# Altium schematic sheet ZynqCoreBoard2.SchDoc
size A3
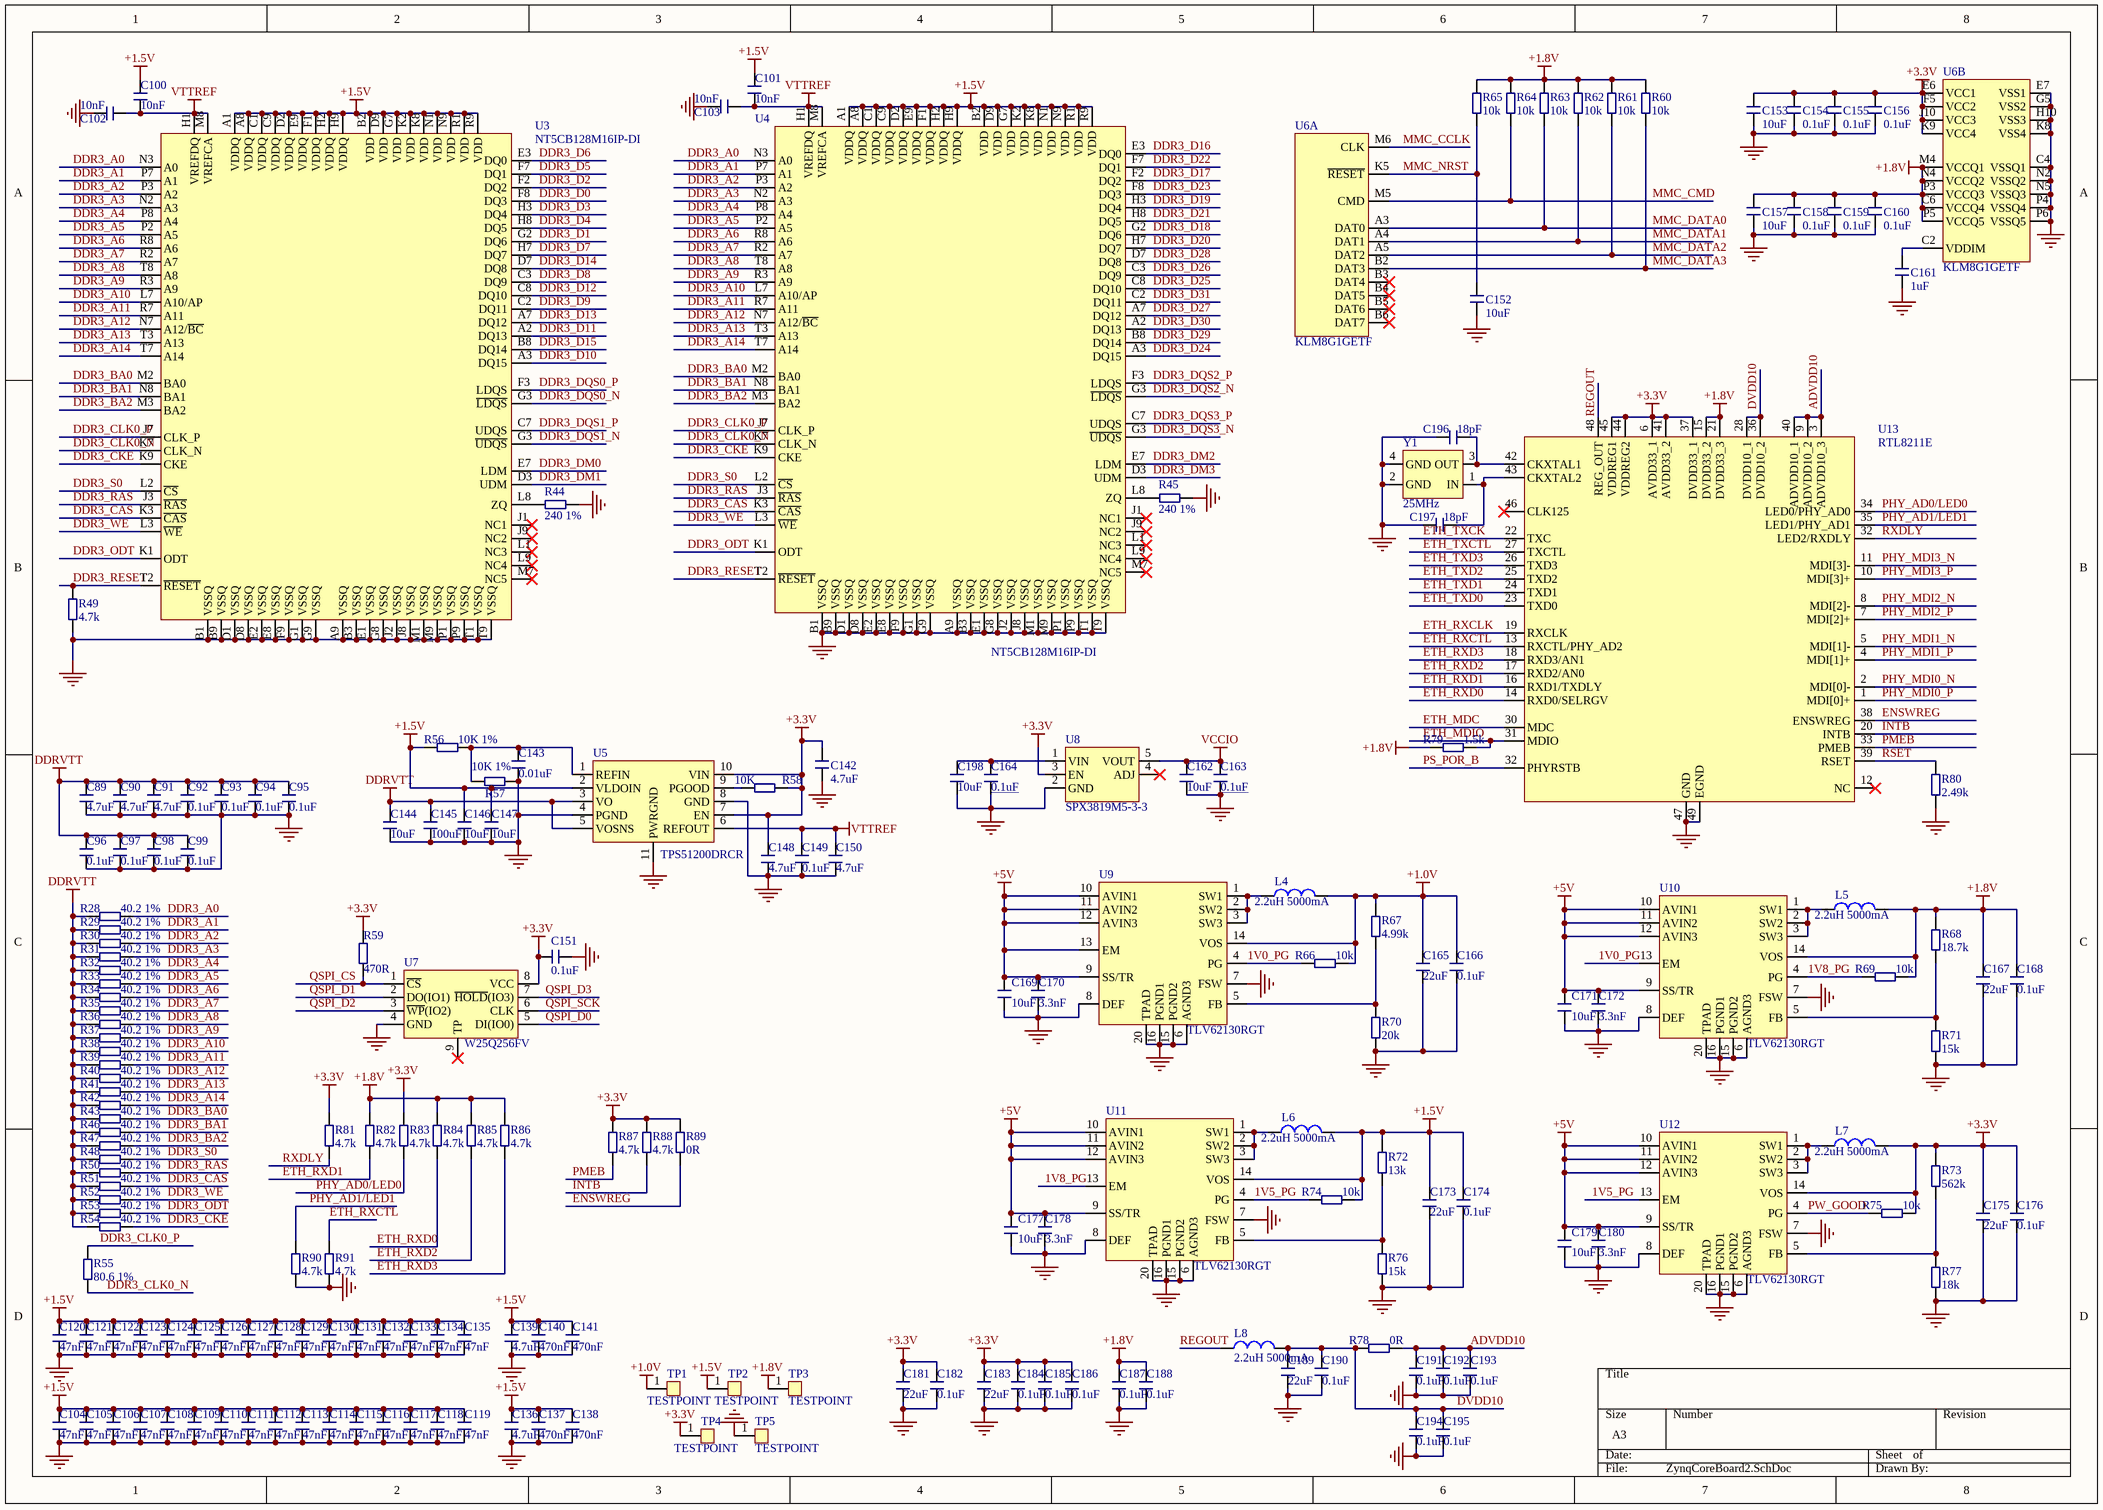
[diagram p0: ZynqCoreBoard2.SchDoc]

## Parts
C89  4.7uF  [C0402]
C90  4.7uF  [C0402]
C91  4.7uF  [C0402]
C92  0.1uF  [C0402]
C93  0.1uF  [C0402]
C94  0.1uF  [C0402]
C95  0.1uF  [C0402]
C96  0.1uF  [C0402]
C97  0.1uF  [C0402]
C98  0.1uF  [C0402]
C99  0.1uF  [C0402]
C100  10nF  [C0402]
C101  10nF  [C0402]
C102  10nF  [C0402]
C103  10nF  [C0402]
C104  47nF  [C0402]
C105  47nF  [C0402]
C106  47nF  [C0402]
C107  47nF  [C0402]
C108  47nF  [C0402]
C109  47nF  [C0402]
C110  47nF  [C0402]
C111  47nF  [C0402]
C112  47nF  [C0402]
C113  47nF  [C0402]
C114  47nF  [C0402]
C115  47nF  [C0402]
C116  47nF  [C0402]
C117  47nF  [C0402]
C118  47nF  [C0402]
C119  47nF  [C0402]
C120  47nF  [C0402]
C121  47nF  [C0402]
C122  47nF  [C0402]
C123  47nF  [C0402]
C124  47nF  [C0402]
C125  47nF  [C0402]
C126  47nF  [C0402]
C127  47nF  [C0402]
C128  47nF  [C0402]
C129  47nF  [C0402]
C130  47nF  [C0402]
C131  47nF  [C0402]
C132  47nF  [C0402]
C133  47nF  [C0402]
C134  47nF  [C0402]
C135  47nF  [C0402]
C136  4.7uF  [C0402]
C137  470nF  [C0402]
C138  470nF  [C0402]
C139  4.7uF  [C0402]
C140  470nF  [C0402]
C141  470nF  [C0402]
C142  4.7uF  [C0402]
C143  0.01uF  [C0402]
C144  10uF  [C0603]
C145  100uF  [C1206]
C146  10uF  [C0603]
C147  10uF  [C0603]
C148  4.7uF  [C0402]
C149  0.1uF  [C0402]
C150  4.7uF  [C0402]
C151  0.1uF  [C0402]
C152  10uF  [C0603]
C153  10uF  [C0603]
C154  0.1uF  [C0402]
C155  0.1uF  [C0402]
C156  0.1uF  [C0402]
C157  10uF  [C0603]
C158  0.1uF  [C0402]
C159  0.1uF  [C0402]
C160  0.1uF  [C0402]
C161  1uF  [C0402]
C162  10uF  [C0805]
C163  0.1uF  [C0402]
C164  0.1uF  [C0402]
C165  22uF  [C0805]
C166  0.1uF  [C0402]
C167  22uF  [C0805]
C168  0.1uF  [C0402]
C169  10uF  [C0603]
C170  3.3nF  [C0402]
C171  10uF  [C0603]
C172  3.3nF  [C0402]
C173  22uF  [C0805]
C174  0.1uF  [C0402]
C175  22uF  [C0805]
C176  0.1uF  [C0402]
C177  10uF  [C0603]
C178  3.3nF  [C0402]
C179  10uF  [C0603]
C180  3.3nF  [C0402]
C181  22uF  [C0805]
C182  0.1uF  [C0402]
C183  22uF  [C0805]
C184  0.1uF  [C0402]
C185  0.1uF  [C0402]
C186  0.1uF  [C0402]
C187  0.1uF  [C0402]
C188  0.1uF  [C0402]
C189  22uF  [C0603]
C190  0.1uF  [C0402]
C191  0.1uF  [C0402]
C192  0.1uF  [C0402]
C193  0.1uF  [C0402]
C194  0.1uF  [C0402]
C195  0.1uF  [C0402]
C196  18pF  [C0402]
C197  18pF  [C0402]
C198  10uF  [C0805]
L4  2.2uH 5000mA  [L-SMD-0630]
L5  2.2uH 5000mA  [L-SMD-0630]
L6  2.2uH 5000mA  [L-SMD-0630]
L7  2.2uH 5000mA  [L-SMD-0630]
L8  2.2uH 5000mA  [L0603]
R28  40.2 1%  [R0402]
R29  40.2 1%  [R0402]
R30  40.2 1%  [R0402]
R31  40.2 1%  [R0402]
R32  40.2 1%  [R0402]
R33  40.2 1%  [R0402]
R34  40.2 1%  [R0402]
R35  40.2 1%  [R0402]
R36  40.2 1%  [R0402]
R37  40.2 1%  [R0402]
R38  40.2 1%  [R0402]
R39  40.2 1%  [R0402]
R40  40.2 1%  [R0402]
R41  40.2 1%  [R0402]
R42  40.2 1%  [R0402]
R43  40.2 1%  [R0402]
R44  240 1%  [R0402]
R45  240 1%  [R0402]
R46  40.2 1%  [R0402]
R47  40.2 1%  [R0402]
R48  40.2 1%  [R0402]
R49  4.7k  [R0402]
R50  40.2 1%  [R0402]
R51  40.2 1%  [R0402]
R52  40.2 1%  [R0402]
R53  40.2 1%  [R0402]
R54  40.2 1%  [R0402]
R55  80.6 1%  [R0402]
R56  10K 1%  [R0402]
R57  10K 1%  [R0402]
R58  10K  [R0402]
R59  470R  [R0402]
R60  10k  [R0402]
R61  10k  [R0402]
R62  10k  [R0402]
R63  10k  [R0402]
R64  10k  [R0402]
R65  10k  [R0402]
R66  10k  [R0402]
R67  4.99k  [R0402]
R68  18.7k  [R0402]
R69  10k  [R0402]
R70  20k  [R0402]
R71  15k  [R0402]
R72  13k  [R0402]
R73  562k  [R0402]
R74  10k  [R0402]
R75  10k  [R0402]
R76  15k  [R0402]
R77  18k  [R0402]
R78  0R  [R0402]
R79  1.5k  [R0402]
R80  2.49k  [R0402]
R81  4.7k  [R0402]
R82  4.7k  [R0402]
R83  4.7k  [R0402]
R84  4.7k  [R0402]
R85  4.7k  [R0402]
R86  4.7k  [R0402]
R87  4.7k  [R0402]
R88  4.7k  [R0402]
R89  0R  [R0402]
R90  4.7k  [R0402]
R91  4.7k  [R0402]
TP1  TESTPOINT  [FPAD_1]
TP2  TESTPOINT  [FPAD_1]
TP3  TESTPOINT  [FPAD_1]
TP4  TESTPOINT  [FPAD_1]
TP5  TESTPOINT  [FPAD_1]
U3  NT5CB128M16IP-DI  [FBGA_96]
U4  NT5CB128M16IP-DI  [FBGA_96]
U5  TPS51200DRCR  [TPS_QFN10]
U6  KLM8G1GETF  [VFBGA]  (parts A,B of 4)
U7  W25Q256FV  [W25Q256FV]
U8  SPX3819M5-3-3  [SOT23-5]
U9  TLV62130RGT  [QFN16_3x3]
U10  TLV62130RGT  [QFN16_3x3]
U11  TLV62130RGT  [QFN16_3x3]
U12  TLV62130RGT  [QFN16_3x3]
U13  RTL8211E  [QFN48]
Y1  25MHz  [OSC 3225-4P]

## Nets
+1.0V: C165.2 C166.2 L4.2 R66.2 R67.2 TP1.1 U9.14(VOS)
+1.5V: C100.2 C101.2 C104.2 C105.2 C106.2 C107.2 C108.2 C109.2 C110.2 C111.2 C112.2 C113.2 C114.2 C115.2 C116.2 C117.2 C118.2 C119.2 C120.2 C121.2 C122.2 C123.2 C124.2 C125.2 C126.2 C127.2 C128.2 C129.2 C130.2 C131.2 C132.2 C133.2 C134.2 C135.2 C136.2 C137.2 C138.2 C139.2 C140.2 C141.2 C146.2 C147.2 C173.2 C174.2 L6.2 R56.1 R72.2 R74.2 TP2.1 U3.A1(VDDQ) U3.A8(VDDQ) U3.B2(VDD) U3.C1(VDDQ) U3.C9(VDDQ) U3.D2(VDDQ) U3.D9(VDD) U3.E9(VDDQ) U3.F1(VDDQ) U3.G7(VDD) U3.H2(VDDQ) U3.H9(VDDQ) U3.K2(VDD) U3.K8(VDD) U3.N1(VDD) U3.N9(VDD) U3.R1(VDD) U3.R9(VDD) U4.A1(VDDQ) U4.A8(VDDQ) U4.B2(VDD) U4.C1(VDDQ) U4.C9(VDDQ) U4.D2(VDDQ) U4.D9(VDD) U4.E9(VDDQ) U4.F1(VDDQ) U4.G7(VDD) U4.H2(VDDQ) U4.H9(VDDQ) U4.K2(VDD) U4.K8(VDD) U4.N1(VDD) U4.N9(VDD) U4.R1(VDD) U4.R9(VDD) U5.2(VLDOIN) U11.14(VOS)
+1.8V: C157.2 C158.2 C159.2 C160.2 C167.2 C168.2 C187.2 C188.2 L5.2 R60.2 R61.2 R62.2 R63.2 R64.2 R65.2 R68.2 R69.2 R79.1 R82.2 R84.2 R85.2 R86.2 TP3.1 U6.C6(VCCQ4) U6.M4(VCCQ1) U6.N4(VCCQ2) U6.P3(VCCQ3) U6.P5(VCCQ5) U10.14(VOS) U13.15(DVDD33_2) U13.21(DVDD33_3)
+3.3V: C142.2 C148.2 C151.2 C153.2 C154.2 C155.2 C156.2 C175.2 C176.2 C181.2 C182.2 C183.2 C184.2 C185.2 C186.2 L7.2 R58.2 R59.2 R73.2 R75.2 R81.2 R83.2 R87.2 R88.2 R89.2 TP4.1 U5.7(EN) U5.10(VIN) U6.E6(VCC1) U6.F5(VCC2) U6.J10(VCC3) U6.K9(VCC4) U7.8(VCC) U8.3(EN) U12.14(VOS) U13.6(AVDD33_1) U13.37(DVDD33_1) U13.41(AVDD33_2) U13.44(VDDREG2) U13.45(VDDREG1)
+5V: C169.2 C170.2 C171.2 C172.2 C177.2 C178.2 C179.2 C180.2 U9.9(SS/TR) U9.10(AVIN1) U9.11(AVIN2) U9.12(AVIN3) U9.13(EM) U10.9(SS/TR) U10.10(AVIN1) U10.11(AVIN2) U10.12(AVIN3) U11.9(SS/TR) U11.10(AVIN1) U11.11(AVIN2) U11.12(AVIN3) U12.9(SS/TR) U12.10(AVIN1) U12.11(AVIN2) U12.12(AVIN3)
DDRVTT: C89.2 C90.2 C91.2 C92.2 C93.2 C94.2 C95.2 C96.2 C97.2 C98.2 C99.2 C144.2 C145.2 R28.1 R29.1 R30.1 R31.1 R32.1 R33.1 R34.1 R35.1 R36.1 R37.1 R38.1 R39.1 R40.1 R41.1 R42.1 R43.1 R46.1 R47.1 R48.1 R50.1 R51.1 R52.1 R53.1 R54.1 U5.3(VO) U5.5(VOSNS)
GND: C89.1 C90.1 C91.1 C92.1 C93.1 C94.1 C95.1 C96.1 C97.1 C98.1 C99.1 C102.1 C103.1 C104.1 C105.1 C106.1 C107.1 C108.1 C109.1 C110.1 C111.1 C112.1 C113.1 C114.1 C115.1 C116.1 C117.1 C118.1 C119.1 C120.1 C121.1 C122.1 C123.1 C124.1 C125.1 C126.1 C127.1 C128.1 C129.1 C130.1 C131.1 C132.1 C133.1 C134.1 C135.1 C136.1 C137.1 C138.1 C139.1 C140.1 C141.1 C142.1 C143.1 C144.1 C145.1 C146.1 C147.1 C148.1 C149.1 C150.1 C151.1 C152.1 C153.1 C154.1 C155.1 C156.1 C157.1 C158.1 C159.1 C160.1 C161.1 C162.1 C163.1 C164.1 C165.1 C166.1 C167.1 C168.1 C169.1 C170.1 C171.1 C172.1 C173.1 C174.1 C175.1 C176.1 C177.1 C178.1 C179.1 C180.1 C181.1 C182.1 C183.1 C184.1 C185.1 C186.1 C187.1 C188.1 C189.1 C190.1 C191.1 C192.1 C193.1 C194.1 C195.1 C196.2 C197.2 C198.1 R44.2 R45.2 R49.1 R57.2 R70.1 R71.1 R76.1 R77.1 R80.1 R90.1 R91.1 TP5.1 U3.A9(VSSQ) U3.B1(VSSQ) U3.B3(VSSQ) U3.B9(VSSQ) U3.D1(VSSQ) U3.D8(VSSQ) U3.E1(VSSQ) U3.E2(VSSQ) U3.E8(VSSQ) U3.F9(VSSQ) U3.G1(VSSQ) U3.G8(VSSQ) U3.G9(VSSQ) U3.J2(VSSQ) U3.J8(VSSQ) U3.M1(VSSQ) U3.M9(VSSQ) U3.P1(VSSQ) U3.P9(VSSQ) U3.T1(VSSQ) U3.T9(VSSQ) U4.A9(VSSQ) U4.B1(VSSQ) U4.B3(VSSQ) U4.B9(VSSQ) U4.D1(VSSQ) U4.D8(VSSQ) U4.E1(VSSQ) U4.E2(VSSQ) U4.E8(VSSQ) U4.F9(VSSQ) U4.G1(VSSQ) U4.G8(VSSQ) U4.G9(VSSQ) U4.J2(VSSQ) U4.J8(VSSQ) U4.M1(VSSQ) U4.M9(VSSQ) U4.P1(VSSQ) U4.P9(VSSQ) U4.T1(VSSQ) U4.T9(VSSQ) U5.4(PGND) U5.8(GND) U5.11(PWRGND) U6.C4(VSSQ1) U6.E7(VSS1) U6.G5(VSS2) U6.H10(VSS3) U6.K8(VSS4) U6.N2(VSSQ2) U6.N5(VSSQ3) U6.P4(VSSQ4) U6.P6(VSSQ5) U7.4(GND) U8.2(GND) U9.6(AGND3) U9.7(FSW) U9.8(DEF) U9.15(PGND2) U9.16(PGND1) U9.20(TPAD) U10.6(AGND3) U10.7(FSW) U10.8(DEF) U10.15(PGND2) U10.16(PGND1) U10.20(TPAD) U11.6(AGND3) U11.7(FSW) U11.8(DEF) U11.15(PGND2) U11.16(PGND1) U11.20(TPAD) U12.6(AGND3) U12.7(FSW) U12.8(DEF) U12.15(PGND2) U12.16(PGND1) U12.20(TPAD) U13.47(GND) U13.49(EGND) Y1.2(GND) Y1.4(GND)
VCCIO: C162.2 C163.2 U8.5(VOUT)
VTTREF: C100.1 C101.1 C102.2 C103.2 C149.2 C150.2 U3.H1(VREFDQ) U3.M8(VREFCA) U4.H1(VREFDQ) U4.M8(VREFCA) U5.6(REFOUT)
1V0_PG: R66.1 U9.4(PG) U10.13(EM)
1V5_PG: R74.1 U11.4(PG) U12.13(EM)
1V8_PG: R69.1 U10.4(PG) U11.13(EM)
ADVDD10: C191.2 C192.2 C193.2 R78.2 U13.3(ADVDD10_3) U13.9(ADVDD10_2) U13.40(ADVDD10_1)
DDR3_A0: R28.2 U3.N3(A0) U4.N3(A0)
DDR3_A1: R29.2 U3.P7(A1) U4.P7(A1)
DDR3_A2: R30.2 U3.P3(A2) U4.P3(A2)
DDR3_A3: R31.2 U3.N2(A3) U4.N2(A3)
DDR3_A4: R32.2 U3.P8(A4) U4.P8(A4)
DDR3_A5: R33.2 U3.P2(A5) U4.P2(A5)
DDR3_A6: R34.2 U3.R8(A6) U4.R8(A6)
DDR3_A7: R35.2 U3.R2(A7) U4.R2(A7)
DDR3_A8: R36.2 U3.T8(A8) U4.T8(A8)
DDR3_A9: R37.2 U3.R3(A9) U4.R3(A9)
DDR3_A10: R38.2 U3.L7(A10/AP) U4.L7(A10/AP)
DDR3_A11: R39.2 U3.R7(A11) U4.R7(A11)
DDR3_A12: R40.2 U3.N7(A12/~{BC}) U4.N7(A12/~{BC})
DDR3_A13: R41.2 U3.T3(A13) U4.T3(A13)
DDR3_A14: R42.2 U3.T7(A14) U4.T7(A14)
DDR3_BA0: R43.2 U3.M2(BA0) U4.M2(BA0)
DDR3_BA1: R46.2 U3.N8(BA1) U4.N8(BA1)
DDR3_BA2: R47.2 U3.M3(BA2) U4.M3(BA2)
DDR3_CAS: R51.2 U3.K3(~{CAS}) U4.K3(~{CAS})
DDR3_CKE: R54.2 U3.K9(CKE) U4.K9(CKE)
DDR3_CLK0_N: R55.1 U3.K7(CLK_N) U4.K7(CLK_N)
DDR3_CLK0_P: R55.2 U3.J7(CLK_P) U4.J7(CLK_P)
DDR3_D0: U3.F8(DQ3)
DDR3_D1: U3.G2(DQ6)
DDR3_D2: U3.F2(DQ2)
DDR3_D3: U3.H3(DQ4)
DDR3_D4: U3.H8(DQ5)
DDR3_D5: U3.F7(DQ1)
DDR3_D6: U3.E3(DQ0)
DDR3_D7: U3.H7(DQ7)
DDR3_D8: U3.C3(DQ9)
DDR3_D9: U3.C2(DQ11)
DDR3_D10: U3.A3(DQ15)
DDR3_D11: U3.A2(DQ13)
DDR3_D12: U3.C8(DQ10)
DDR3_D13: U3.A7(DQ12)
DDR3_D14: U3.D7(DQ8)
DDR3_D15: U3.B8(DQ14)
DDR3_D16: U4.E3(DQ0)
DDR3_D17: U4.F2(DQ2)
DDR3_D18: U4.G2(DQ6)
DDR3_D19: U4.H3(DQ4)
DDR3_D20: U4.H7(DQ7)
DDR3_D21: U4.H8(DQ5)
DDR3_D22: U4.F7(DQ1)
DDR3_D23: U4.F8(DQ3)
DDR3_D24: U4.A3(DQ15)
DDR3_D25: U4.C8(DQ10)
DDR3_D26: U4.C3(DQ9)
DDR3_D27: U4.A7(DQ12)
DDR3_D28: U4.D7(DQ8)
DDR3_D29: U4.B8(DQ14)
DDR3_D30: U4.A2(DQ13)
DDR3_D31: U4.C2(DQ11)
DDR3_DM0: U3.E7(LDM)
DDR3_DM1: U3.D3(UDM)
DDR3_DM2: U4.E7(LDM)
DDR3_DM3: U4.D3(UDM)
DDR3_DQS0_N: U3.G3(~{LDQS})
DDR3_DQS0_P: U3.F3(LDQS)
DDR3_DQS1_N: U3.G3(~{UDQS})
DDR3_DQS1_P: U3.C7(UDQS)
DDR3_DQS2_N: U4.G3(~{LDQS})
DDR3_DQS2_P: U4.F3(LDQS)
DDR3_DQS3_N: U4.G3(~{UDQS})
DDR3_DQS3_P: U4.C7(UDQS)
DDR3_ODT: R53.2 U3.K1(ODT) U4.K1(ODT)
DDR3_RAS: R50.2 U3.J3(~{RAS}) U4.J3(~{RAS})
DDR3_RESET: R49.2 U3.T2(~{RESET}) U4.T2(~{RESET})
DDR3_S0: R48.2 U3.L2(~{CS}) U4.L2(~{CS})
DDR3_WE: R52.2 U3.L3(~{WE}) U4.L3(~{WE})
DVDD10: C189.2 C190.2 C194.2 C195.2 L8.2 R78.1 U13.28(DVDD10_1) U13.36(DVDD10_2)
ENSWREG: R89.1 U13.38(ENSWREG)
ETH_MDC: U13.30(MDC)
ETH_MDIO: R79.2 U13.31(MDIO)
ETH_RXCLK: U13.19(RXCLK)
ETH_RXCTL: R91.2 U13.13(RXCTL/PHY_AD2)
ETH_RXD0: R84.1 U13.14(RXD0/SELRGV)
ETH_RXD1: R82.1 U13.16(RXD1/TXDLY)
ETH_RXD2: R85.1 U13.17(RXD2/AN0)
ETH_RXD3: R86.1 U13.18(RXD3/AN1)
ETH_TXCK: U13.22(TXC)
ETH_TXCTL: U13.27(TXCTL)
ETH_TXD0: U13.23(TXD0)
ETH_TXD1: U13.24(TXD1)
ETH_TXD2: U13.25(TXD2)
ETH_TXD3: U13.26(TXD3)
INTB: R88.1 U13.20(INTB)
MMC_CCLK: U6.M6(CLK)
MMC_CMD: R64.1 U6.M5(CMD)
MMC_DATA0: R63.1 U6.A3(DAT0)
MMC_DATA1: R62.1 U6.A4(DAT1)
MMC_DATA2: R61.1 U6.A5(DAT2)
MMC_DATA3: R60.1 U6.B2(DAT3)
MMC_NRST: C152.2 R65.1 U6.K5(~{RESET})
PHY_AD0/LED0: R83.1 U13.34(LED0/PHY_AD0)
PHY_AD1/LED1: R90.2 U13.35(LED1/PHY_AD1)
PHY_MDI0_N: U13.2(MDI[0]-)
PHY_MDI0_P: U13.1(MDI[0]+)
PHY_MDI1_N: U13.5(MDI[1]-)
PHY_MDI1_P: U13.4(MDI[1]+)
PHY_MDI2_N: U13.8(MDI[2]-)
PHY_MDI2_P: U13.7(MDI[2]+)
PHY_MDI3_N: U13.11(MDI[3]-)
PHY_MDI3_P: U13.10(MDI[3]+)
PMEB: R87.1 U13.33(PMEB)
PS_POR_B: U13.32(PHYRSTB)
PW_GOOD: R75.1 U12.4(PG)
QSPI_CS: R59.1 U7.1(~{CS})
QSPI_D0: U7.5(DI(IO0))
QSPI_D1: U7.2(DO(IO1))
QSPI_D2: U7.3(~{WP}(IO2))
QSPI_D3: U7.7(~{HOLD}(IO3))
QSPI_SCK: U7.6(CLK)
REGOUT: L8.1 U13.48(REG_OUT)
RSET: R80.2 U13.39(RSET)
RXDLY: R81.1 U13.32(LED2/RXDLY)
NetC143_2: C143.2 R56.2 R57.1 U5.1(REFIN)
NetC161_2: C161.2 U6.C2(VDDIM)
NetC164_2: C164.2 C198.2 U8.1(VIN)
NetC196_1: C196.1 U13.42(CKXTAL1) Y1.3(OUT)
NetC197_1: C197.1 U13.43(CKXTAL2) Y1.1(IN)
NetL4_1: L4.1 U9.1(SW1) U9.2(SW2) U9.3(SW3)
NetL5_1: L5.1 U10.1(SW1) U10.2(SW2) U10.3(SW3)
NetL6_1: L6.1 U11.1(SW1) U11.2(SW2) U11.3(SW3)
NetL7_1: L7.1 U12.1(SW1) U12.2(SW2) U12.3(SW3)
NetR44_1: R44.1 U3.L8(ZQ)
NetR45_1: R45.1 U4.L8(ZQ)
NetR58_1: R58.1 U5.9(PGOOD)
NetR67_1: R67.1 R70.2 U9.5(FB)
NetR68_1: R68.1 R71.2 U10.5(FB)
NetR72_1: R72.1 R76.2 U11.5(FB)
NetR73_1: R73.1 R77.2 U12.5(FB)

Not connected (* = marked no-connect by the designer): U3 J1(NC1)* J9(NC2)* L1(NC3)* L9(NC4)* M7(NC5)*; U4 J1(NC1)* J9(NC2)* L1(NC3)* L9(NC4)* M7(NC5)*; U6 B3(DAT4)* B4(DAT5)* B5(DAT6)* B6(DAT7)*; U7 9(TP)*; U8 4(ADJ)*; U13 12(NC)* 46(CLK125)*

## Library data of the parts
C89-C143 C148-C151 C154-C156 C158-C161 C163 C164 C166 C168 C170 C172 C174 C176 C178 C180 C182 C184-C188 C190-C197 = C0402
C144 C146 C147 C152 C153 C157 C169 C171 C177 C179 C189 = C0603
C145 = C1206
C162 C165 C167 C173 C175 C181 C183 C198 = C0805
L4-L7 = L_2.2uH_5000mA
L8 = L0603
R28-R91 = R0402
Y1 = XTAL_25MHz_3225